# EAGLE design led_boost_test (EAGLE 8.6.3)
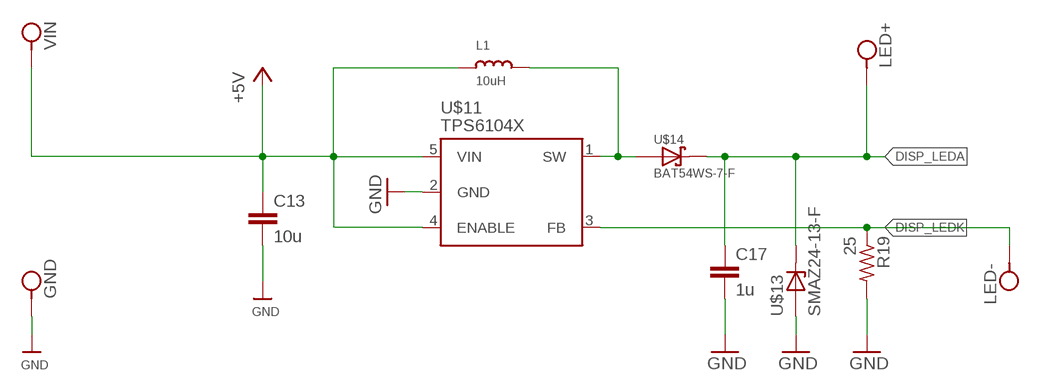
[diagram p0: schematic, sheet 1]

## Parts
C13  10u  C-EUC0805K  [C0805K]
C17  1u  C-EUC0805K  [C0805K]
GND  MOTOR_PAD  [MOTOR_PAD]
L1  10uH  INDUCTORNR5040  [INDUCTOR_5X5MM_NR5040_NOTHERMALS]
LED+  MOTOR_PAD  [MOTOR_PAD]
LED-  MOTOR_PAD  [MOTOR_PAD]
R19  25  R-US_R0805  [R0805]
U$11  TPS6104X  [SOT23-5L]
U$13  SMAZ24-13-F  [SMA_DIODE]
U$14  BAT54WS-7-F  [SOD323]
VIN  MOTOR_PAD  [MOTOR_PAD]

## Nets
+5V: C13.1 L1.P$1 U$11.4(ENABLE) U$11.5(VIN) VIN.P$1
DISP_LEDA: C17.1 LED+.P$1 U$13.C U$14.1(C)
DISP_LEDK: LED-.P$1 R19.1 U$11.3(FB)
GND: C13.2 C17.2 GND.P$1 R19.2 U$11.2(GND) U$13.A
N$8: L1.P$2 U$11.1(SW) U$14.2(A)

## Library data of the parts
C13 C17 = rcl:C-EU: CAPACITOR, European symbol
GND LED+ LED- VIN = motor_controller_parts:MOTOR_PAD: Motor Pad Pad to solder a motor wire to the PCB
L1 = microbuilder:INDUCTOR: Inductors 0603: 10nH Ceramic Inductor - microwire antenna/RF (Digikey: 712-1434-2-ND) 0805: 560nH Ceramic Inductor - RF (Digikey: 553-1047-1-ND) 270nH Ceramic Inductor - Q = 40@250MHz, +-5%, 1 Ohm DC Resistance (Digikey: 535-10506-2-ND) 1007 (2518 Metric) SMT: 10µH 10% 250mOhm 820mA 1007 Inductor (Digikey: 587-2189-1-ND) 22µH 10% 500mOhm 580mA 1007 Inductor (Digikey: 587-2190-1-ND) 47µH 10% 950mOhm 420mA 1007 Inductor (Digikey: 587-2191-1-ND) 47µH 5% 100mOhm 1A 1008 Inductor (Digikey: 732-1816-1-ND) 5.0x5.0mm (Taiyo Yuden NR5040 Series) 6.8µH 20% 2.3A 64mOhm Inductor (Digikey: 587-2374-2-ND) 5.0x5.0mm (TDK VLC5045 Series) 4.7µH 20% 3.3A 34mOhm Inductor (Digikey: 445-6526-1-ND) 6.8µH 20% 2.7A 46mOhm Inductor (Digikey: 445-6527-1-ND) 6.0x6.0mm (TDK VLC6045 Series) 4.7µH 20% 3.8A 27mOhm Inductor (Digikey: 445-6538-2-ND) 6.8µH 20% 3A 41mOhm Inductor (Digikey: 445-6540-1-ND) 6.2µH 30% 2.2A 45mOhm Inductor (Digikey: SRR5028-6R2YCT-ND) - Not TDK VLC6045 but footprint should match 6.0x6.0mm (TDK SLF6045 Series) 6.8uH 30% 2A 33mOhm Inductor (Digikey: 445-4572-1-ND, Mouser: 810-SLF645T6R8N2R0PF) 6.0x6.0mm (Sumida CDRH5D28 Series) 6.2uH 30% 1.8A 45mOhm Inductor (Digikey: 308-1542-1-ND) Taiyo Yuden NR3015T2R2M - 2.2uH 20% 1.5A (Digikey: 587-1648-2-ND, Mouser: 963-NR3015T2R2M) - Used with TI TPS62172 CoilCraft RFID Transponder Coil - MA5532-AE (For use with AS3935 Lightning Sensor)
R19 = rcl:R-US_: RESISTOR, American symbol; SPICEPREFIX: R
U$11 = Display_Custom:TPS6104X: Texas Insturments TPS6104x Low-Power DC-DC Boost Converter in SOT-23 http://www.ti.com/lit/ds/symlink/tps61041.pdf
U$13 = Display_Custom:SMAZ24-13-F: Diodes Inc 24V Zener Diode 24V 1W zener diode is SMA package http://www.ti.com/lit/ds/symlink/tps61041.pdf
U$14 = Display_Custom:BAT54WS-7-F: Diodes Incorporated BAT54WS-7-F Small Form Factor 30V 100mA Schottkey Diode https://www.diodes.com/assets/Datasheets/ds30098.pdf

## Board
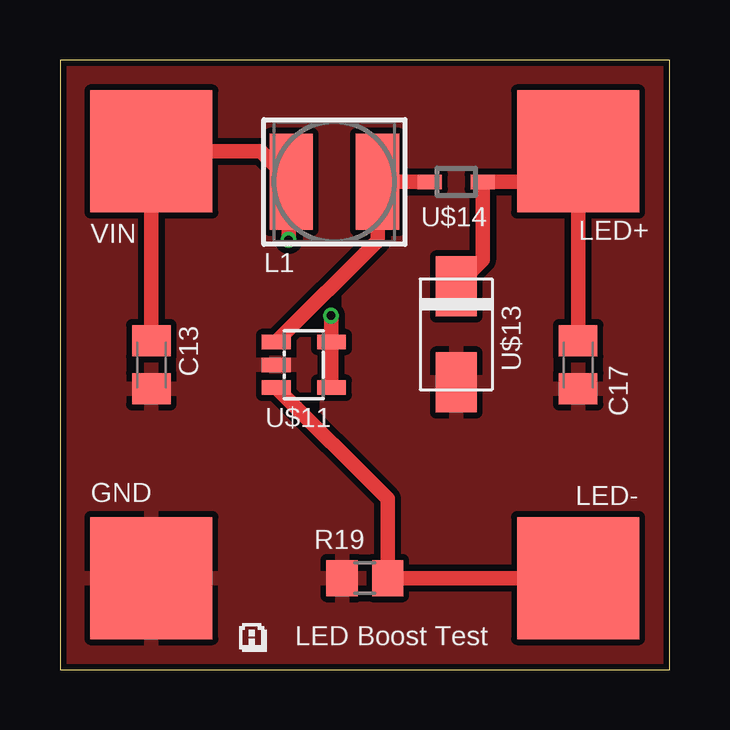
[diagram p1: board, top side]
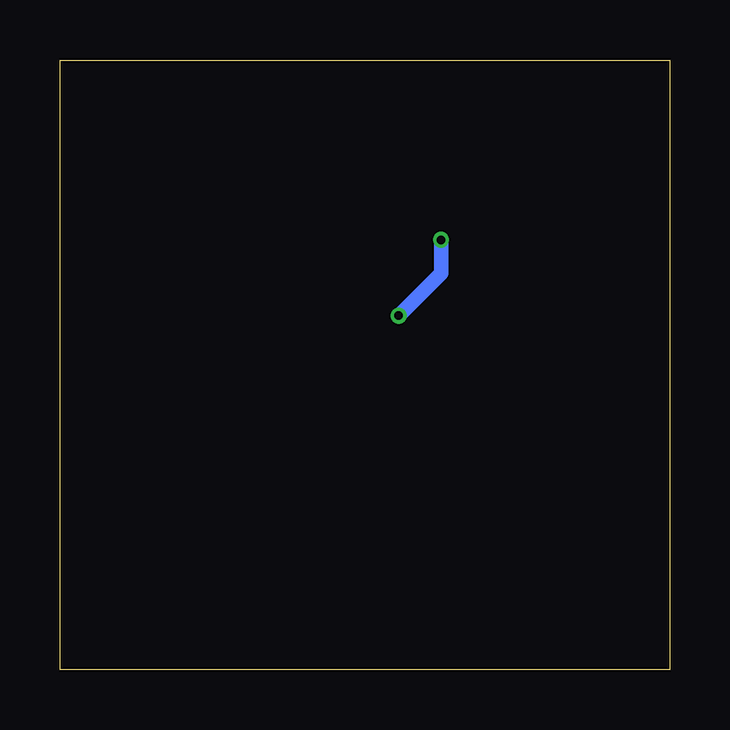
[diagram p2: board, bottom side, seen from below]

Size 25.4 x 25.4 mm. Coordinates in mm from the lower left corner, seen from the top.
Outline: 0,0 25.4,0 25.4,25.4 0,25.4 0,0
Copper layers (1*16): Top 0.035mm / dielectric 1.5mm / Bottom 0.035mm
Design rules "SeeedStudio_2layer_DRU_no_angle_20140221": minimum track width 6mil, minimum drill 12mil, track to track 6mil, track to pad 6mil, pad to pad 6mil, via to via 6mil, smd to smd 0mil, copper to edge 10mil, drill to drill 10mil, minimum pad ring 10mil, minimum via ring 6mil, stop-mask expansion 2mil, vias tented up to drill 100mil, thermal gap 10mil

### Footprints (pad centres in the part's own frame; a part is rotated, then mirrored left to right if it is on the bottom)
C0805K = smd 1.3 x 1.6: 1 -1,0; 2 1,0
MOTOR_PAD = smd 5.08 x 5.08: P$1 0,0
INDUCTOR_5X5MM_NR5040_NOTHERMALS = smd 1.8 x 4: P$1 -1.8,0; P$2 1.8,0
R0805 = smd 1.3 x 1.5: 1 -0.95,0; 2 0.95,0
SOT23-5L = smd 0.6 x 1.2: 1 -0.95,-1.15; 2 0,-1.15; 3 0.95,-1.15; 4 0.95,1.15; 5 -0.95,1.15
SMA_DIODE = smd 2.5 x 1.7: A 2,0; C -2,0
SOD323 = smd 1 x 0.6: 1 -1.1,0; 2 1.1,0

### Placement (x,y rotation side)
C13  3.81,12.7 270 top
C17  21.59,12.7 270 top
GND  3.81,3.81 0 top
L1  11.43,20.32 0 top
LED+  21.59,21.59 180 top
LED-  21.59,3.81 0 top
R19  12.7,3.81 180 top
U$11  10.16,12.7 270 top
U$13  16.51,13.97 270 top
U$14  16.51,20.32 180 top
VIN  3.81,21.59 180 top

### Tracks (layer width: path | path; a pad name or v marks a point on that pad's centre or on a via)
+5V  (via drill 0.35)
  Top 0.61: U$11.4 U$11.5 11.31,14.72 v11.29,14.75 | C13.1 VIN.P$1 8.36,21.59 L1.P$1 9.53,20.21 v9.53,17.91
  Bottom 0.61: v11.29,14.75 9.53,16.51 v9.53,17.91
DISP_LEDA
  Top 0.61: U$13.C 17.61,17.07 U$14.1 20.32,20.32 LED+.P$1 C17.1
DISP_LEDK
  Top 0.61: LED-.P$1 R19.1 13.65,7.11 U$11.3
GND
  pour Top (isolate 0.254): 0,25.4 0,0 25.4,0 25.4,25.4
N$8
  Top 0.61: U$11.1 13.23,17.87 L1.P$2 U$14.2

### Text on the board
tNames: LED Boost Test